# EasyEDA Pro project pcb.epro

# Schematic ESP32 Water Valve
Board Name: ESP32 Water Valve; Create Date: 2025-06-25; Page Name: Sheet_1; Project Name: ESP32 Water Valve; Schematic Name: ESP32 Water Valve; Update Date: 2025-07-14; Add into BOM: yes; Company: N/A; Convert to PCB: yes; Date: 2025-06-22; Draw By: Derrick Choi; REV: 1.0; Sheet: 1/1; spicePre: .
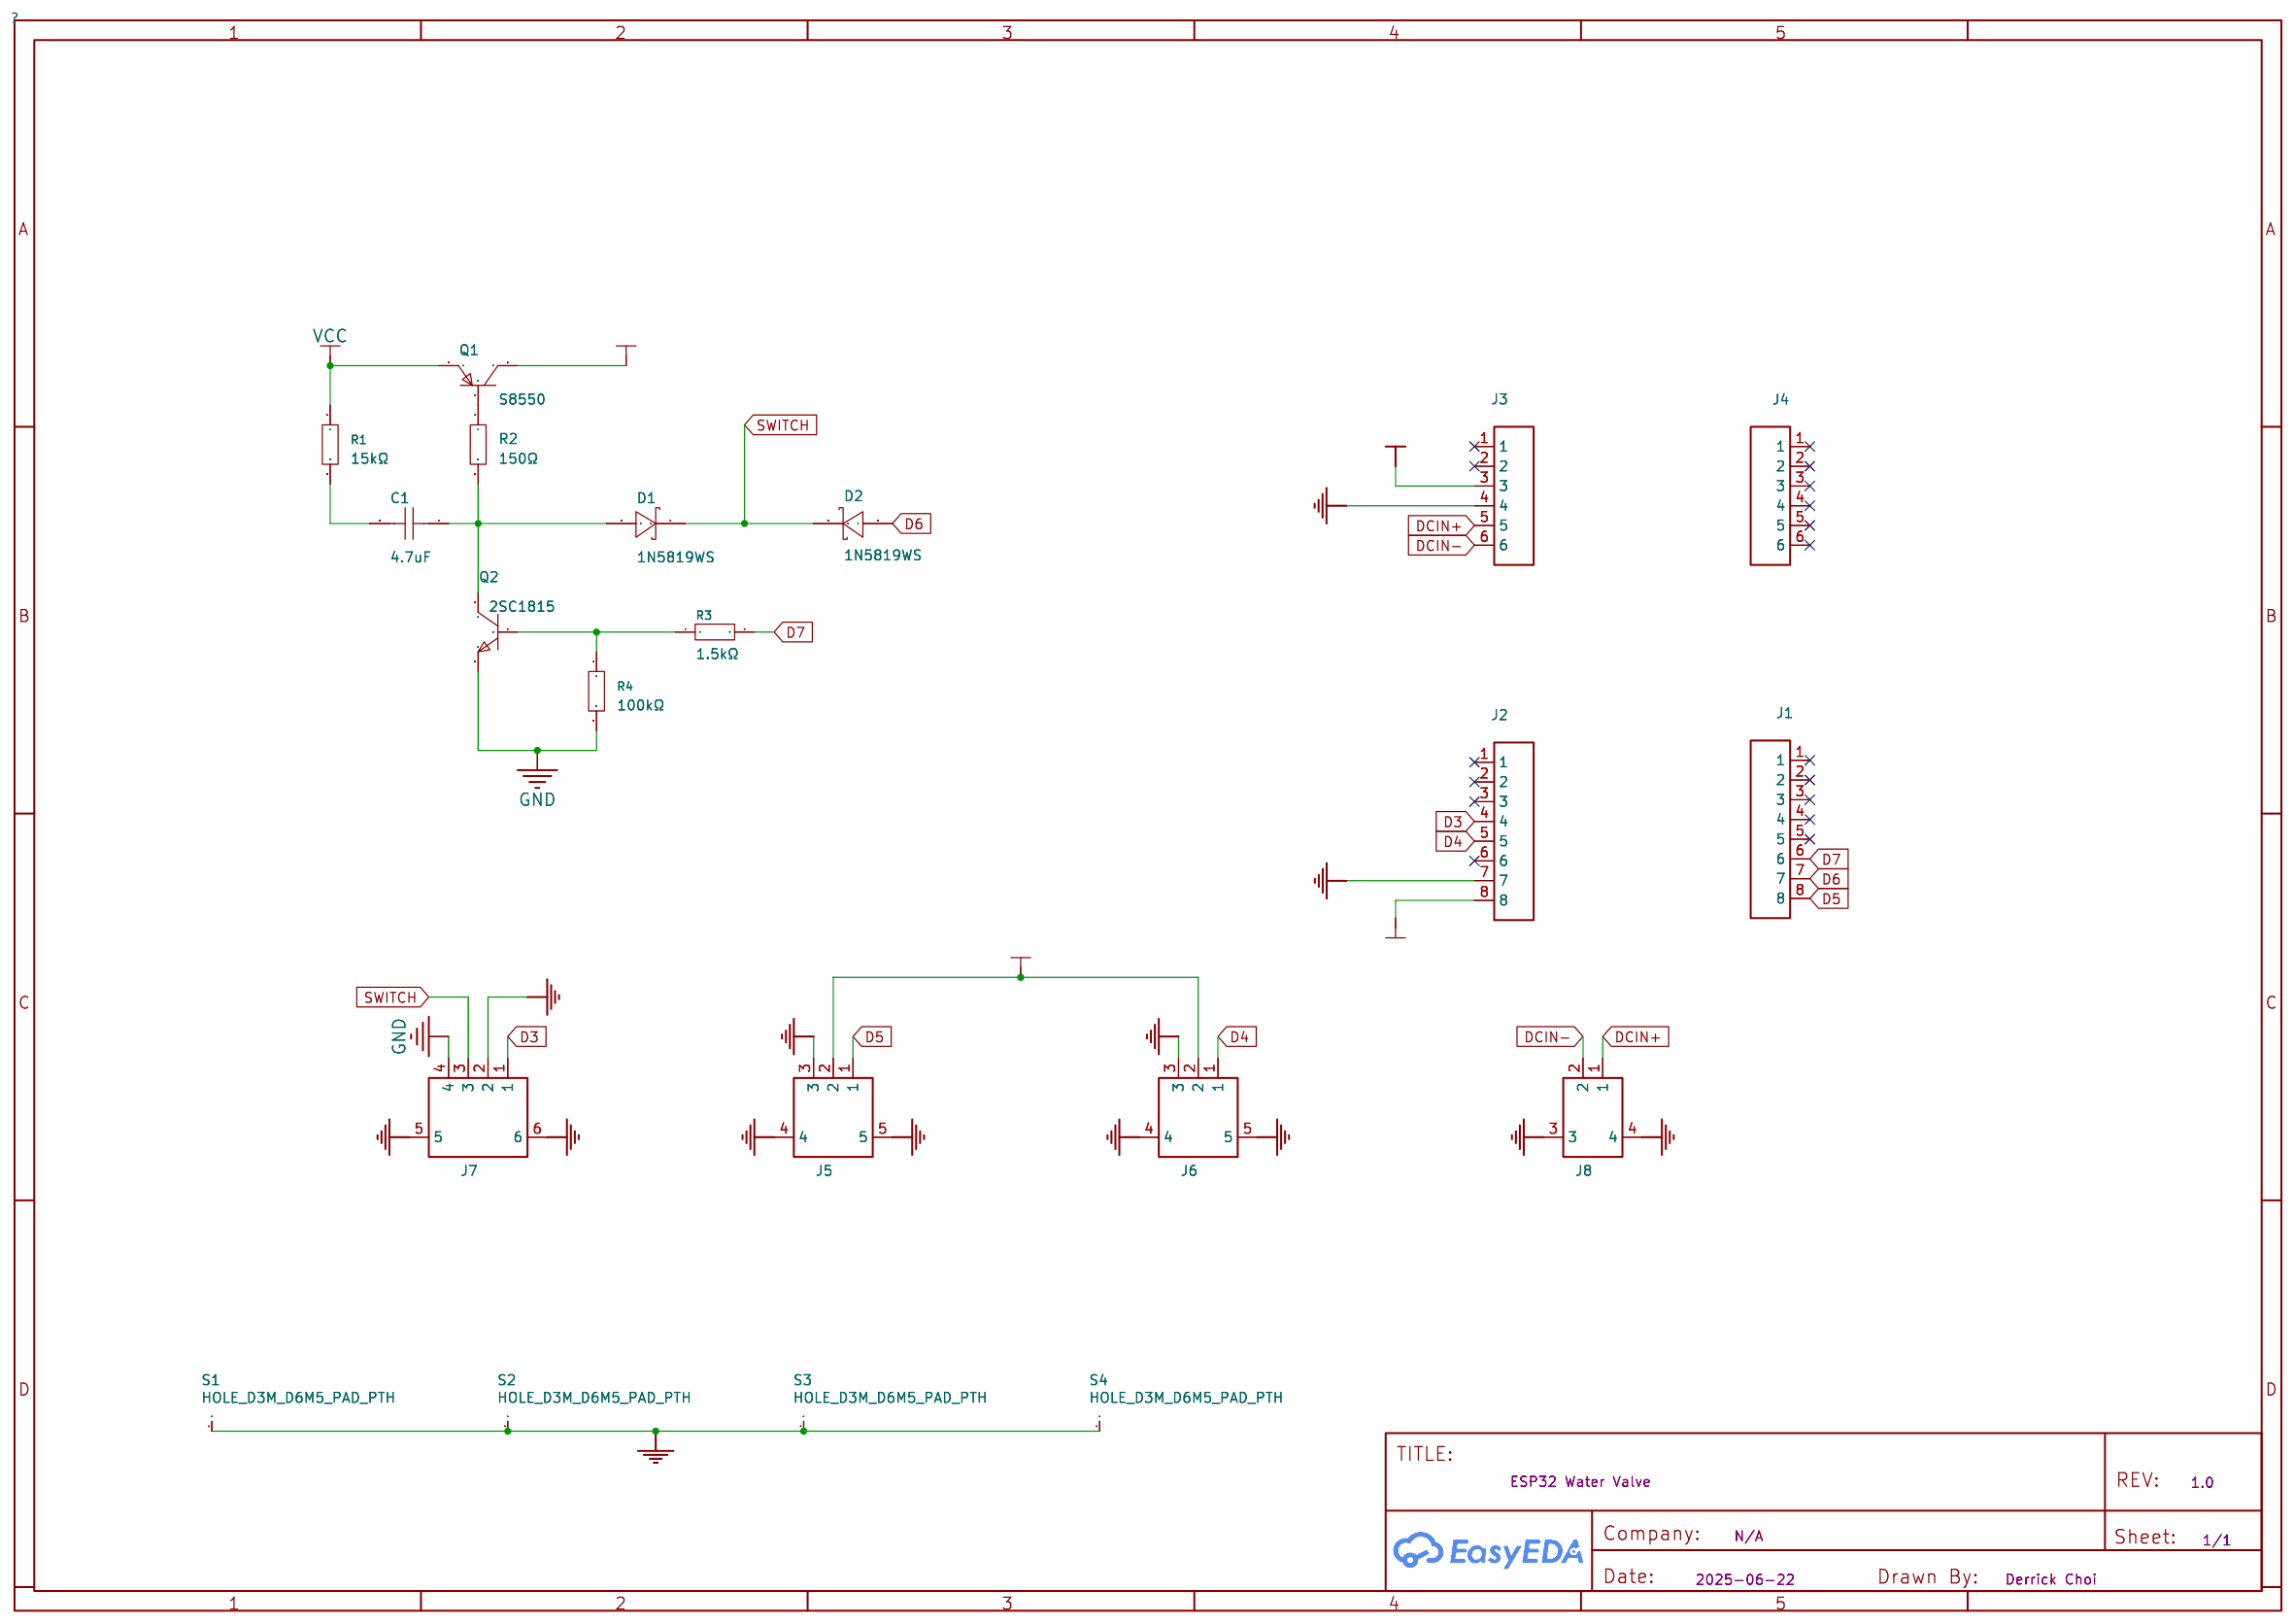
[diagram p0: schematic sheet]

## Parts
C1  4.7uF  [C0402]
D1  1N5819WS  [SOD-323_L1.8-W1.3-LS2.5-RD]
D2  1N5819WS  [SOD-323_L1.8-W1.3-LS2.5-RD]
J1  22850108ANG1SYA01  [HDR-TH_8P-P2.54-V-F-1]
J2  22850108ANG1SYA01  [HDR-TH_8P-P2.54-V-F-1]
J3  DS1023-1x6SF11  [HDR-TH_6P-P2.54-V-F]
J4  DS1023-1x6SF11  [HDR-TH_6P-P2.54-V-F]
J5  B3B-PH-SM4-TB(LF)(SN)  [CONN-SMD_B3B-PH-SM4-TB-LF-SN]
J6  B3B-PH-SM4-TB(LF)(SN)  [CONN-SMD_B3B-PH-SM4-TB-LF-SN]
J7  B4B-PH-SM4-TB(LF)(SN)  [CONN-SMD_B4B-PH-SM4-TB-LF-SN]
J8  B2B-PH-SM4-TB(LF)(SN)  [CONN-SMD_B2B-PH-SM4-TB-LF-SN]
Q1  S8550  [SOT-23-3_L2.9-W1.3-P1.90-LS2.4-BR]
Q2  2SC1815  [SOT-23-3_L2.9-W1.3-P1.90-LS2.4-BR]
R1  15kΩ  [R0402]
R2  150Ω  [R0402]
R3  1.5kΩ  [R0402]
R4  100kΩ  [R0402]
S1  HOLE_D3M_D6M5_PAD_PTH  [HOLE_D3M_D6M5_PAD_PTH]
S2  HOLE_D3M_D6M5_PAD_PTH  [HOLE_D3M_D6M5_PAD_PTH]
S3  HOLE_D3M_D6M5_PAD_PTH  [HOLE_D3M_D6M5_PAD_PTH]
S4  HOLE_D3M_D6M5_PAD_PTH  [HOLE_D3M_D6M5_PAD_PTH]

## Library data of the parts
C1 = CL05A475MP5NRNC: Capacitance: Tolerance:±20% Tolerance:±20% Voltage Rated: Temperature Coefficient:; LCSC Part Name: 4.7uF ±20% 10V; Supplier Part: C23733; Manufacturer: SAMSUNG(三星); Supplier Footprint: 0402; JLCPCB Part Class: Basic Part; Datasheet: https://atta.szlcsc.com/upload/public/pdf/source/20160218/1457707763339.pdf; Supplier: LCSC; Tolerance: ±20%
D1 D2 = 1N5819WS_C191023: Forward Voltage (Vf@If):600mV@1A Reverse Voltage (Vr):40V Rectified Current:1A; LCSC Part Name: 电压:40V 电流:1A; Supplier Part: C191023; Manufacturer: Hottech(合科泰); Supplier Footprint: SOD-323; Datasheet: https://atta.szlcsc.com/upload/public/pdf/source/20220428/3CB86FD8D28D653594B4E35F9D5AEFD9.pdf; Supplier: LCSC; Forward Voltage (Vf@If): 600mV@1A; Reverse Voltage (Vr): 40V; Rectified Current: 1A
J1 J2 = 22850108ANG1SYA01: Holes Structure:1x8P Pitch:2.54mm Row Spacing:- Mounting Type:Direct Insert Number of Rows:Single Row Number of Holes:8P Current Rating (Max):3A Insulation Height:8.5mm Contact Material:Brass Contact Plating:- Operating Temperature Range:-40℃~+105℃ Operat; LCSC Part Name: 1x8P 间距:2.54mm 直插; Supplier Part: C429957; Manufacturer: JILN(锦凌); Supplier Footprint: 插件,P=2.54mm; JLCPCB Part Class: Extended Part; Datasheet: https://atta.szlcsc.com/upload/public/pdf/source/20190920/C429966_F6288D72CB1EF194DAF75E8AC5D57877.pdf; Supplier: LCSC; Holes Structure: 1x8P; Pitch: 2.54mm; Mounting Type: Direct Insert; Number of Rows: Single Row; Number of Holes: 8P; Current Rating (Max): 3A; Insulation Height: 8.5mm; Contact Material: Brass; Operating Temperature Range: -40℃~+105℃; Soldering Temperature(Max): 200℃
J3 J4 = DS1023-1x6SF11: Holes Structure:1x6P Pitch:2.54mm Mounting Type:Direct Insert Number of Rows:Single Row Insulation Height:8.5mm Contact Plating:Gold; LCSC Part Name: 1x6P 间距:2.54mm 直插 黑色; Supplier Part: C7509518; Manufacturer: CONNFLY; Supplier Footprint: 插件,P=2.54mm; JLCPCB Part Class: Extended Part; Datasheet: https://atta.szlcsc.com/upload/public/pdf/source/20230815/86840008895D6C8A81EE1AA38A34BEA2.pdf; Supplier: LCSC; Holes Structure: 1x6P; Pitch: 2.54mm; Mounting Type: Direct Insert; Number of Rows: Single Row; Insulation Height: 8.5mm; Contact Plating: Gold
J5 J6 = B3B-PH-SM4-TB(LF)(SN): Pins Structure:1x3P Pitch:2mm Mounting Style:Brick nogging Reference Series:PH Number of Pins:3P Number of Rows:1 Number of PINs Per Row:3 Row Spacing:- Current Rating (Max):2A Contact Material:Copper Alloy Contact Plating:Tin Operating Temperature Range:; LCSC Part Name: 1x3P 间距:2mm 立贴 系列:PH; Supplier Part: C160353; Manufacturer: JST; Supplier Footprint: SMD,P=2mm; JLCPCB Part Class: Extended Part; Datasheet: https://atta.szlcsc.com/upload/public/pdf/source/20181010/C265101_22107ACC4D8714694FDA2DD97145FA81.pdf; Supplier: LCSC; Pins Structure: 1x3P; Pitch: 2mm; Mounting Style: Brick nogging; Reference Series: PH; Number of Pins: 3P; Number of Rows: 1; Number of PINs Per Row: 3; Current Rating (Max): 2A; Contact Material: Copper Alloy; Contact Plating: Tin; Operating Temperature Range: -25℃~+85℃; Rated Voltage (Max): 100V; Plastic Material: PA; Flame Retardant Rating: UL94V-0; Supplementary Features: 辅助焊脚; Colour: 米色; Z-Height of the Board: 6.6mm; X-Length of Bottom Edge on Board (Spacing Line): 9.95mm; Y-Width of Bottom Edge on Board: 7mm
J7 = B4B-PH-SM4-TB(LF)(SN): Pins Structure:1x4P Pitch:2mm Mounting Style:Brick nogging Reference Series:PH Number of Pins:4P Number of Rows:1 Number of PINs Per Row:4 Row Spacing:- Current Rating (Max):2A Contact Material:Copper Alloy Contact Plating:Tin Operating Temperature Range:; LCSC Part Name: 1x4P 间距:2mm 立贴 系列:PH; Supplier Part: C160354; Manufacturer: JST; Supplier Footprint: SMD,P=2mm; JLCPCB Part Class: Extended Part; Datasheet: https://atta.szlcsc.com/upload/public/pdf/source/20181010/C265101_22107ACC4D8714694FDA2DD97145FA81.pdf; Supplier: LCSC; Pins Structure: 1x4P; Pitch: 2mm; Mounting Style: Brick nogging; Reference Series: PH; Number of Pins: 4P; Number of Rows: 1; Number of PINs Per Row: 4; Current Rating (Max): 2A; Contact Material: Copper Alloy; Contact Plating: Tin; Operating Temperature Range: -25℃~+85℃; Rated Voltage (Max): 100V; Plastic Material: PA; Flame Retardant Rating: UL94V-0; Supplementary Features: 辅助焊脚; Colour: 米色; Z-Height of the Board: 6.6mm; X-Length of Bottom Edge on Board (Spacing Line): 11.95mm; Y-Width of Bottom Edge on Board: 7mm
J8 = B2B-PH-SM4-TB(LF)(SN): Pins Structure:1x2P Pitch:2mm Mounting Style:Brick nogging Reference Series:PH Number of Pins:2P Number of Rows:1 Number of PINs Per Row:2 Row Spacing:- Current Rating (Max):2A Contact Material:Copper Alloy Contact Plating:Tin Operating Temperature Range:; LCSC Part Name: 1x2P 间距:2mm 立贴 系列:PH; Supplier Part: C160352; Manufacturer: JST; Supplier Footprint: SMD,P=2mm; JLCPCB Part Class: Extended Part; Datasheet: https://atta.szlcsc.com/upload/public/pdf/source/20181010/C265101_22107ACC4D8714694FDA2DD97145FA81.pdf; Supplier: LCSC; Pins Structure: 1x2P; Pitch: 2mm; Mounting Style: Brick nogging; Reference Series: PH; Number of Pins: 2P; Number of Rows: 1; Number of PINs Per Row: 2; Current Rating (Max): 2A; Contact Material: Copper Alloy; Contact Plating: Tin; Operating Temperature Range: -25℃~+85℃; Rated Voltage (Max): 100V; Plastic Material: PA; Flame Retardant Rating: UL94V-0; Supplementary Features: 辅助焊脚; Colour: 米色; Z-Height of the Board: 6.6mm; X-Length of Bottom Edge on Board (Spacing Line): 7.95mm; Y-Width of Bottom Edge on Board: 7mm
Q1 = S8550_C20069126: type:PNP Current - Collector(Ic): Collector - Emitter Voltage VCEO: Pd - Power Dissipation:300mW DC Current Gain:120@500mA,1.0V DC Current Gain:120@500mA,1.0V Transition frequency(fT):150MHz Current - Collector Cutoff:100nA Vce Saturation(VCE(sat)):500mV; LCSC Part Name: hFE:200-350，丝印:2TY S8550; Supplier Part: C20069126; Manufacturer: 宏嘉诚; Supplier Footprint: SOT-23; JLCPCB Part Class: Extended Part; Datasheet: https://atta.szlcsc.com/upload/public/pdf/source/20250107/6DAD7E9AA702AA129A4A0106BAAB5F5A.pdf; Supplier: LCSC; type: PNP; Pd - Power Dissipation: 300mW; DC Current Gain: 120@500mA,1.0V; Transition frequency(fT): 150MHz; Current - Collector Cutoff: 100nA; Vce Saturation(VCE(sat)): 500mV; Operating Temperature: -55℃~+150℃
Q2 = 2SC1815_C20069143: type:NPN Current - Collector(Ic): Collector - Emitter Voltage VCEO: Pd - Power Dissipation:200mW DC Current Gain:130@2.0mA,6.0V DC Current Gain:130@2.0mA,6.0V Transition frequency(fT):80MHz Current - Collector Cutoff:100nA Vce Saturation(VCE(sat)):250mV O; LCSC Part Name: hFE:200-400，丝印:HF 2SC1815; Supplier Part: C20069143; Manufacturer: 宏嘉诚; Supplier Footprint: SOT-23; Datasheet: https://atta.szlcsc.com/upload/public/pdf/source/20250107/D800663ECE5DDB9E1BAE33D07FAC6089.pdf; Supplier: LCSC; type: NPN; Pd - Power Dissipation: 200mW; DC Current Gain: 130@2.0mA,6.0V; Transition frequency(fT): 80MHz; Current - Collector Cutoff: 100nA; Vce Saturation(VCE(sat)): 250mV; Operating Temperature: -55℃~+150℃
R1 = 0402WGF1502TCE: Type:Thick Film Resistors Resistance:15kΩ Tolerance:±1% Tolerance:±1% Power(Watts): Overload Voltage (Max): Temperature Coefficient:±100ppm/℃ Temperature Coefficient:±100ppm/℃ Operating Temperature Range:-55℃~+155℃ Operating Temperature Range:-55℃~+155℃; LCSC Part Name: 15kΩ ±1% 62.5mW 厚膜电阻; Supplier Part: C25756; Manufacturer: UNI-ROYAL(厚声); Supplier Footprint: 0402; JLCPCB Part Class: Basic Part; Datasheet: https://atta.szlcsc.com/upload/public/pdf/source/20200306/C422600_1E6D84923E4A46A82E41ADD87F860B5C.pdf; Supplier: LCSC; Type: Thick Film Resistors; Tolerance: ±1%; Temperature Coefficient: ±100ppm/℃; Operating Temperature Range: -55℃~+155℃
R2 = 0402WGF1500TCE: Type:Thick Film Resistors Resistance: Tolerance:±1% Tolerance:±1% Power(Watts): Overload Voltage (Max): Temperature Coefficient:±100ppm/℃ Temperature Coefficient:±100ppm/℃ Operating Temperature Range:-55℃~+155℃ Operating Temperature Range:-55℃~+155℃; LCSC Part Name: 150Ω ±1% 62.5mW 厚膜电阻; Supplier Part: C25082; Manufacturer: UNI-ROYAL(厚声); Supplier Footprint: 0402; JLCPCB Part Class: Extended Part; Datasheet: https://atta.szlcsc.com/upload/public/pdf/source/20200306/C422600_1E6D84923E4A46A82E41ADD87F860B5C.pdf; Supplier: LCSC; Type: Thick Film Resistors; Tolerance: ±1%; Temperature Coefficient: ±100ppm/℃; Operating Temperature Range: -55℃~+155℃
R3 = 0402WGF1501TCE: Type:Thick Film Resistors Resistance:1.5kΩ Tolerance:±1% Tolerance:±1% Power(Watts): Overload Voltage (Max): Temperature Coefficient:±100ppm/℃ Temperature Coefficient:±100ppm/℃ Operating Temperature Range:-55℃~+155℃ Operating Temperature Range:-55℃~+155℃; LCSC Part Name: 1.5kΩ ±1% 62.5mW 厚膜电阻; Supplier Part: C25867; Manufacturer: UNI-ROYAL(厚声); Supplier Footprint: 0402; JLCPCB Part Class: Basic Part; Datasheet: https://atta.szlcsc.com/upload/public/pdf/source/20200306/C422600_1E6D84923E4A46A82E41ADD87F860B5C.pdf; Supplier: LCSC; Type: Thick Film Resistors; Tolerance: ±1%; Temperature Coefficient: ±100ppm/℃; Operating Temperature Range: -55℃~+155℃
R4 = 0402WGF1003TCE: Type:Thick Film Resistors Resistance:100kΩ Tolerance:±1% Tolerance:±1% Power(Watts): Overload Voltage (Max): Temperature Coefficient:±100ppm/℃ Temperature Coefficient:±100ppm/℃ Operating Temperature Range:-55℃~+155℃ Operating Temperature Range:-55℃~+155℃; LCSC Part Name: 100kΩ ±1% 62.5mW 厚膜电阻; Supplier Part: C25741; Manufacturer: UNI-ROYAL(厚声); Supplier Footprint: 0402; JLCPCB Part Class: Basic Part; Datasheet: https://atta.szlcsc.com/upload/public/pdf/source/20200306/C422600_1E6D84923E4A46A82E41ADD87F860B5C.pdf; Supplier: LCSC; Type: Thick Film Resistors; Tolerance: ±1%; Temperature Coefficient: ±100ppm/℃; Operating Temperature Range: -55℃~+155℃
S1-S4 = HOLE_D3M_D6M5_PAD_PTH: Contributor: Zid Zap; sourceId: zBJD82WQ8; timeStamp: 1450434696; spicePre: S; Check: false

## Nets
GND: J2.7 J3.4 J5.3 J5.4 J5.5 J6.3 J6.4 J6.5 J7.2 J7.4 J7.5 J7.6 J8.3 J8.4 Q2.2(E) R4.2 S1.1 S2.1 S3.1 S4.1
VCC: J3.3 Q1.2(E) R1.1
VDD: J2.8 J5.2 J6.2 Q1.3(C)
D3: J2.4 J7.1
D4: J2.5 J6.1
D5: J1.8 J5.1
D6: D2.2(A) J1.7
D7: J1.6 R3.2
DCIN+: J3.5 J8.1
DCIN-: J3.6 J8.2
SWITCH: D1.1(K) D2.1(K) J7.3
$1N4802: Q1.1(B) R2.1
$1N5083: Q2.1(B) R3.1 R4.1
$1N7152: C1.2 R1.2
$1N7157: C1.1 D1.2(A) Q2.3(C) R2.2

Not connected (* = marked no-connect by the designer): J1 1* 2* 3* 4* 5*; J2 1* 2* 3* 6*; J3 1* 2*; J4 1* 2* 3* 4* 5* 6*

# Board 1-PCB_PCB_ESP32 Water Valve
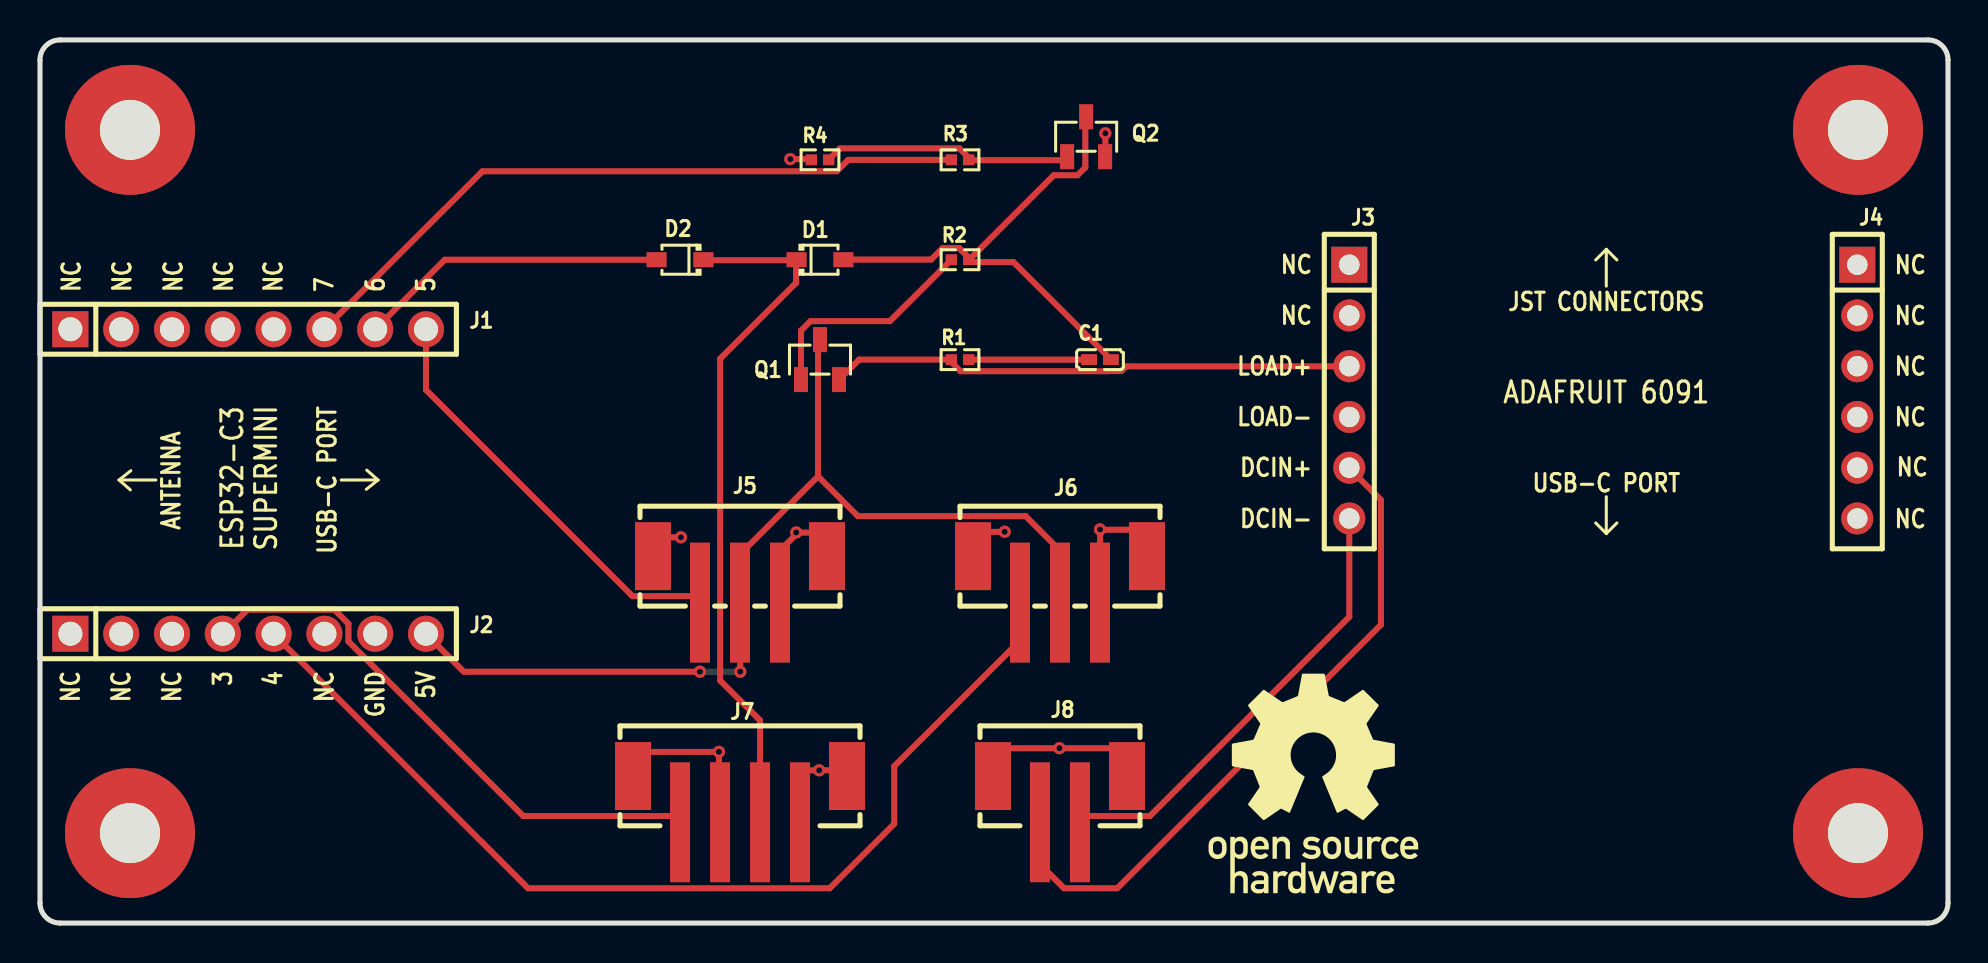
[diagram p1: board, top side]
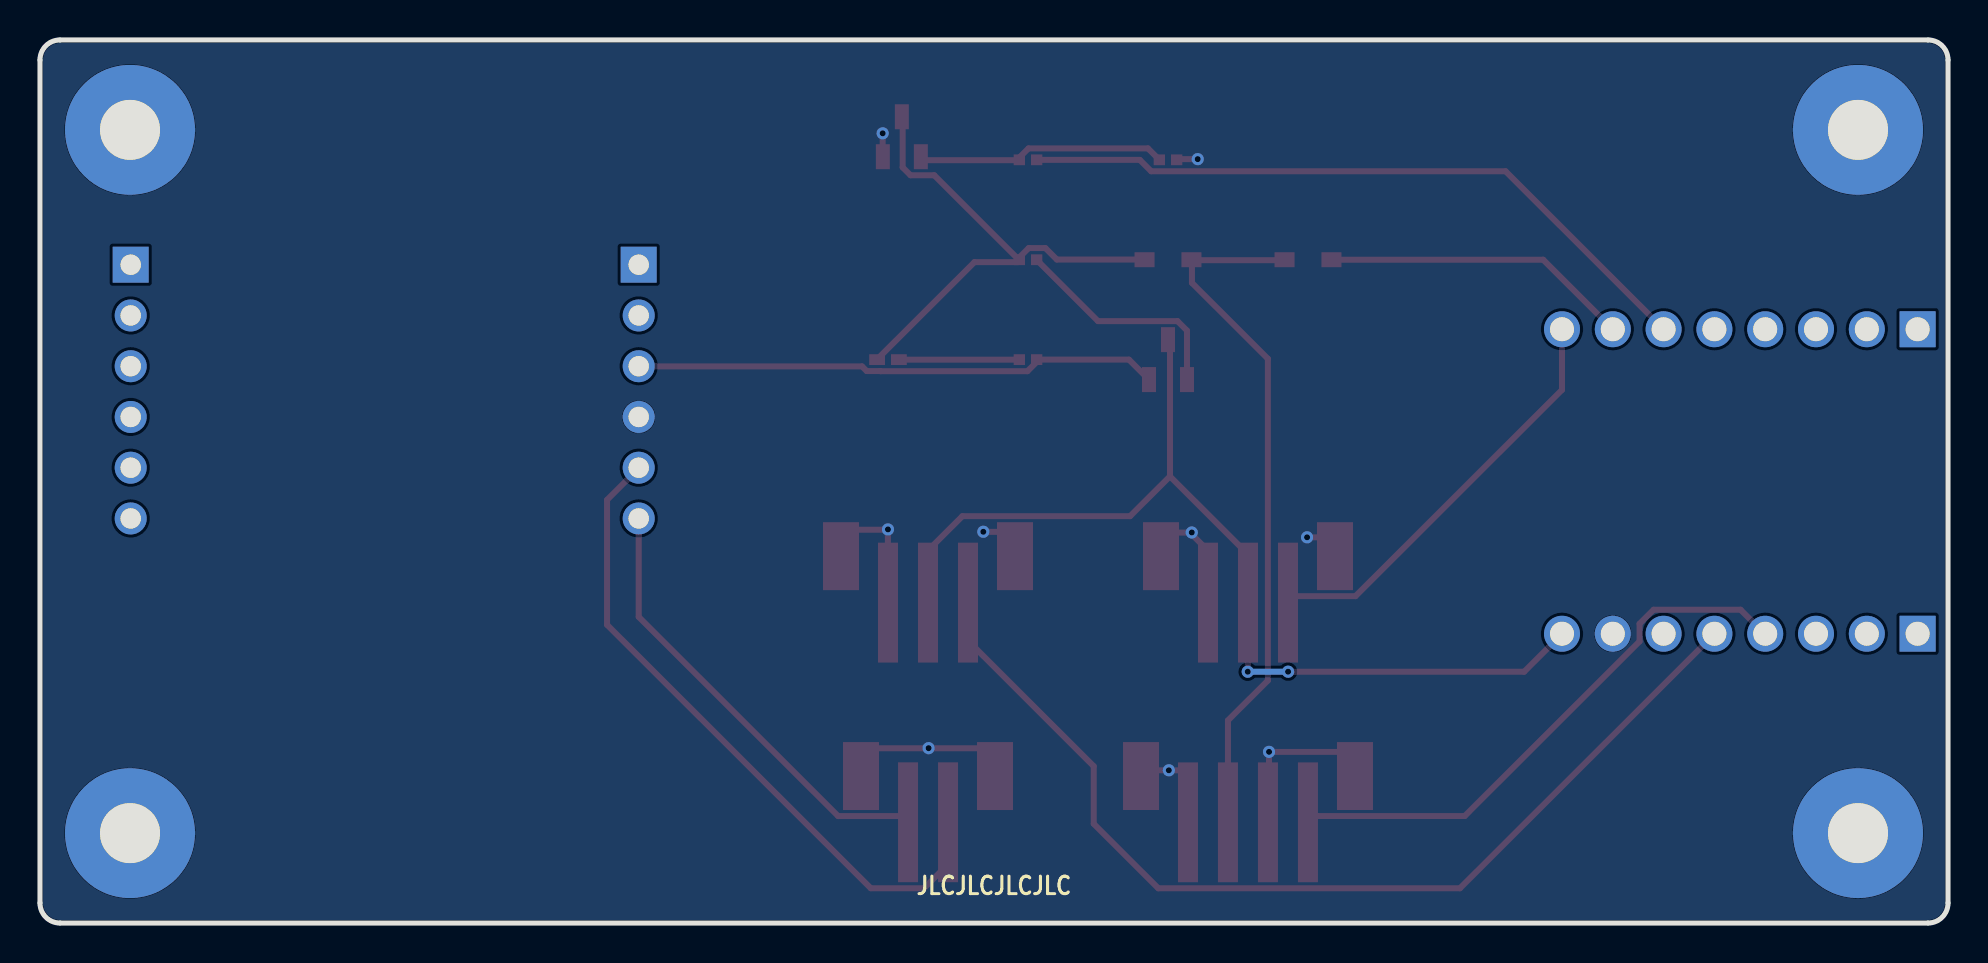
[diagram p2: board, bottom side, seen from below]

Outline 95.4 x 44.2 mm; copper layers: Top Layer, Bottom Layer. Coordinates in mm from the lower left corner of the outline.
Outline path: 0,43.2 0,1 arc(0.29,0.29) 1,0 94.4,0 arc(95.11,0.29) 95.4,1 95.4,43.2 arc(95.11,43.91) 94.4,44.2 1,44.2 arc(0.29,43.91) 0,43.2
Stack: Top Layer 0.035mm / Dielectric1 1.51mm FR4 er 4.5 / Bottom Layer 0.035mm

## Design rules (mm)
template: User Custom Config
spacing Default (default): track to track 0.152, other pairs 0 to 0.152
track width Default (default): min 0.3, default 0.3, max 25.4
differential pair differentialPair (default): width min 0.127, default 0.254, max 2.54; gap min 0.152, default 0.152
via Default (default): diameter min 0.61, default 0.61, max 100.025; hole min 0.305, default 0.305, max 59.995

## Placement (name value [footprint] x y rotation side)
C1  4.7uF  [C0402]  53 28.2 180 top
D1  1N5819WS  [SOD-323_L1.8-W1.3-LS2.5-RD]  39 33.2 0 top
D2  1N5819WS  [SOD-323_L1.8-W1.3-LS2.5-RD]  32 33.2 180 top
J1  22850108ANG1SYA01  [HDR-TH_8P-P2.54-V-F-1]  10.41 29.72 0 top
J2  22850108ANG1SYA01  [HDR-TH_8P-P2.54-V-F-1]  10.41 14.48 0 top
J3  DS1023-1x6SF11  [HDR-TH_6P-P2.54-V-F]  65.47 26.6 270 top
J4  DS1023-1x6SF11  [HDR-TH_6P-P2.54-V-F]  90.87 26.6 270 top
J5  B3B-PH-SM4-TB(LF)(SN)  [CONN-SMD_B3B-PH-SM4-TB-LF-SN]  35 17.2 180 top
J6  B3B-PH-SM4-TB(LF)(SN)  [CONN-SMD_B3B-PH-SM4-TB-LF-SN]  51 17.2 180 top
J7  B4B-PH-SM4-TB(LF)(SN)  [CONN-SMD_B4B-PH-SM4-TB-LF-SN]  35 6.2 180 top
J8  B2B-PH-SM4-TB(LF)(SN)  [CONN-SMD_B2B-PH-SM4-TB-LF-SN]  51 6.2 180 top
Q1  S8550  [SOT-23-3_L2.9-W1.3-P1.90-LS2.4-BR]  39 28.2 270 top
Q2  2SC1815  [SOT-23-3_L2.9-W1.3-P1.90-LS2.4-BR]  52.31 39.36 270 top
R1  15kΩ  [R0402]  46 28.2 0 top
R2  150Ω  [R0402]  46 33.2 0 top
R3  1.5kΩ  [R0402]  46 38.2 180 top
R4  100kΩ  [R0402]  39 38.2 180 top
S1  -  [HOLE_D3M_D6M5_PAD_PTH]  4.5 39.7 0 top
S2  -  [HOLE_D3M_D6M5_PAD_PTH]  90.9 39.7 0 top
S3  -  [HOLE_D3M_D6M5_PAD_PTH]  4.5 4.5 90 top
S4  -  [HOLE_D3M_D6M5_PAD_PTH]  90.9 4.5 180 top

## Footprints (pads in the part's own frame, mm; a bottom-side part is the same pattern mirrored in y, then rotated)
C0402
  rect 0.79x0.54 smd: 1(-0.545,0) 2(0.545,0)
CONN-SMD_B2B-PH-SM4-TB-LF-SN
  rect 1x6 smd: 1(1.002,1.157) 2(-0.998,1.157)
  rect 1.8x3.4 smd: 3(-3.35,-1.157) 4(3.35,-1.157)
CONN-SMD_B3B-PH-SM4-TB-LF-SN
  rect 1x6 smd: 1(2,1.163) 2(0,1.163) 3(-2,1.163)
  rect 1.8x3.4 smd: 4(-4.35,-1.163) 5(4.35,-1.163)
CONN-SMD_B4B-PH-SM4-TB-LF-SN
  rect 1x6 smd: 1(2.997,1.158) 2(0.997,1.158) 3(-1.003,1.158) 4(-3.001,1.158)
  rect 1.8x3.4 smd: 5(-5.349,-1.158) 6(5.349,-1.158)
HDR-TH_6P-P2.54-V-F
  rect 1.8x1.8 hole 1.02: 1(-6.35,0)
  round 1.6 hole 1.02: 2(-3.81,0) 3(-1.27,0) 4(1.27,0) 5(3.81,0) 6(6.35,0)
HDR-TH_8P-P2.54-V-F-1
  rect 1.8x1.8 hole 1.2: 1(-8.89,0)
  round 1.8 hole 1.2: 2(-6.35,0) 3(-3.81,0) 4(-1.27,0) 5(1.27,0) 6(3.81,0) 7(6.35,0) 8(8.89,0)
HOLE_D3M_D6M5_PAD_PTH
  round 6.5 hole 3: 1(0,0)
R0402
  rect 0.566x0.54 smd: 1(-0.433,0) 2(0.433,0)
SOD-323_L1.8-W1.3-LS2.5-RD
  rect 1x0.75 smd: 1(-1.173,0) 2(1.173,0)
SOT-23-3_L2.9-W1.3-P1.90-LS2.4-BR
  rect 1.25x0.7 smd: 1(1,-0.95) 2(1,0.95) 3(-1,0)

## Nets
As in the schematic.

Pads without a net: J1 1 2 3 4 5; J2 1 2 3 6; J3 1 2; J4 1 2 3 4 5 6

## Via types
v1: diameter 0.61, hole 0.305, Top Layer to Bottom Layer, 11 vias

## Routing (per net, layer and track width the routed paths; a pad name or vN(x,y) marks a point on that pad's centre or on a via; arc(x,y) is an arc through that point)
GND: length 21.9
  Top Layer w0.3: 36.98,18.63 37.81,19.46 37.81,19.54 ; 33.95,8.57 33.95,7.64 33.94,7.63 ; 38.56,38.23 38.56,38.23 37.52,38.23 ; 37.98,7.64 37.99,7.64 38.96,7.64 ; 37.81,19.54 37.81,19.54 ; 37.81,19.54 37.81,19.54 ; 37.81,19.54 38.8,19.54 38.8,19.54 ; 53.01,19.7 53.01,18.73 53,18.73 ; 53.73,8.75 53.73,8.75 50.97,8.75 ; 30.09,8.54 30.11,8.57 33.94,8.57 ; 50.97,8.75 48.14,8.75 48.14,8.76 ; 53.01,19.69 55.17,19.69 ; 53.27,39.53 53.27,38.76 ; 40.11,7.64 40.1,7.64 38.97,7.64 ; 31.09,19.3 31.09,19.31 32.05,19.31 ; 47.02,19.59 47.02,19.58 48.23,19.58
  vias: v1(32.05,19.31) v1(33.95,8.57) v1(37.51,38.23) v1(37.81,19.55) v1(38.96,7.64) v1(48.23,19.58) v1(50.97,8.75) v1(53,19.7) v1(53.27,39.53)
VCC: length 26.3
  Top Layer w0.3: 45.46,28.18 46.03,27.62 53.37,27.62 53.38,27.63 54.06,27.63 54.3,27.86 65.45,27.86 ; 39.95,27.19 40.95,28.2 45.55,28.2
VDD: length 43.1
  Top Layer w0.3: 35.02,18.52 35.07,18.52 38.9,22.35 ; Q1.3 38.9,29.1 38.9,22.35 ; 38.91,22.35 40.89,20.36 49.28,20.36 50.88,18.76 ; 38.9,22.35 38.9,22.34 ; 38.9,22.35 38.91,22.36 ; 35.01,13.37 35.01,12.64 ; 33,12.58 21.19,12.58 19.3,14.47
  Bottom Layer w0.3: 33,12.58 33,12.58 v1(35.01,12.58)
  vias: v1(33,12.58)
D3: length 28.3
  Top Layer w0.3: 31.99,4.91 31.55,5.36 24.16,5.36 15.42,14.1 15.42,14.98 14.72,15.68 10.37,15.68 9.17,14.48
D4: length 49.4
  Top Layer w0.3: 49.09,13.78 48.65,13.78 42.71,7.85 42.71,4.97 39.49,1.74 24.4,1.74 11.68,14.46
D5: length 21.1
  Top Layer w0.3: J5.1 32.68,16.36 29.62,16.36 19.3,26.68 J1.8
D6: length 15.5
  Top Layer w0.3: J1.7 20.24,33.2 D2.2
D7: length 34.9
  Top Layer w0.3: 14.2,29.71 22.12,37.63 39.84,37.63 40.41,38.2 45.57,38.2
DCIN+: length 33.6
  Top Layer w0.3: 65.48,22.75 67.05,21.18 67.05,14.93 53.86,1.74 51.2,1.74 50,2.94 J8.1
DCIN-: length 22.7
  Top Layer w0.3: 65.5,20.28 J3.6 65.47,15.33 55.49,5.35 52.31,5.35 J8.2
SWITCH: length 35.2
  Top Layer w0.3: J7.3 36,10.14 34.01,12.14 34.01,28.24 37.8,32.04 37.8,33.18 ; D2.1 33.2,33.18 37.8,33.18 ; 37.8,33.18 D1.1
$1N4802: length 11.4
  Top Layer w0.3: 38.05,27.21 38.05,29.65 38.53,30.13 42.5,30.13 45.57,33.2
$1N5083: length 12.4
  Top Layer w0.3: 39.44,38.21 40,38.77 45.97,38.77 46.43,38.32 46.43,38.2 ; 51.35,38.18 46.46,38.18
$1N7152: length 6.1
  Top Layer w0.3: 52.46,28.2 52.45,28.2 52.29,28.2 ; 52.3,28.1 52.29,28.11 52.29,28.2 ; 52.29,28.2 46.44,28.2
$1N7157: length 26.1
  Top Layer w0.3: 46.48,33.08 48.68,33.08 53.55,28.2 ; 52.29,40.36 52.29,40.34 52.27,40.32 52.27,37.82 51.87,37.43 50.69,37.43 46.47,33.22 46.47,33.27 45.96,33.78 45.13,33.78 44.56,33.21 40.2,33.21 40.19,33.2

## Copper pours and planes (outline as drawn; the poured copper is in the pictures)
GND on Bottom Layer: -3.39,47.82 97.96,47.82 97.96,-4.22 -3.39,-4.22

## Text on the board
Bottom Silkscreen Layer: JLCJLCJLCJLC
Top Silkscreen Layer: JST CONNECTORS | USB-C PORT | ANTENNA | NC | LOAD+ | LOAD- | DCIN+ | DCIN- | 7 | 6 | 5 | 3 | 4 | GND | 5V | ADAFRUIT 6091 | ESP32-C3 / SUPERMINI
